# EAGLE design payload-section-B-2 (EAGLE 7.3.0)
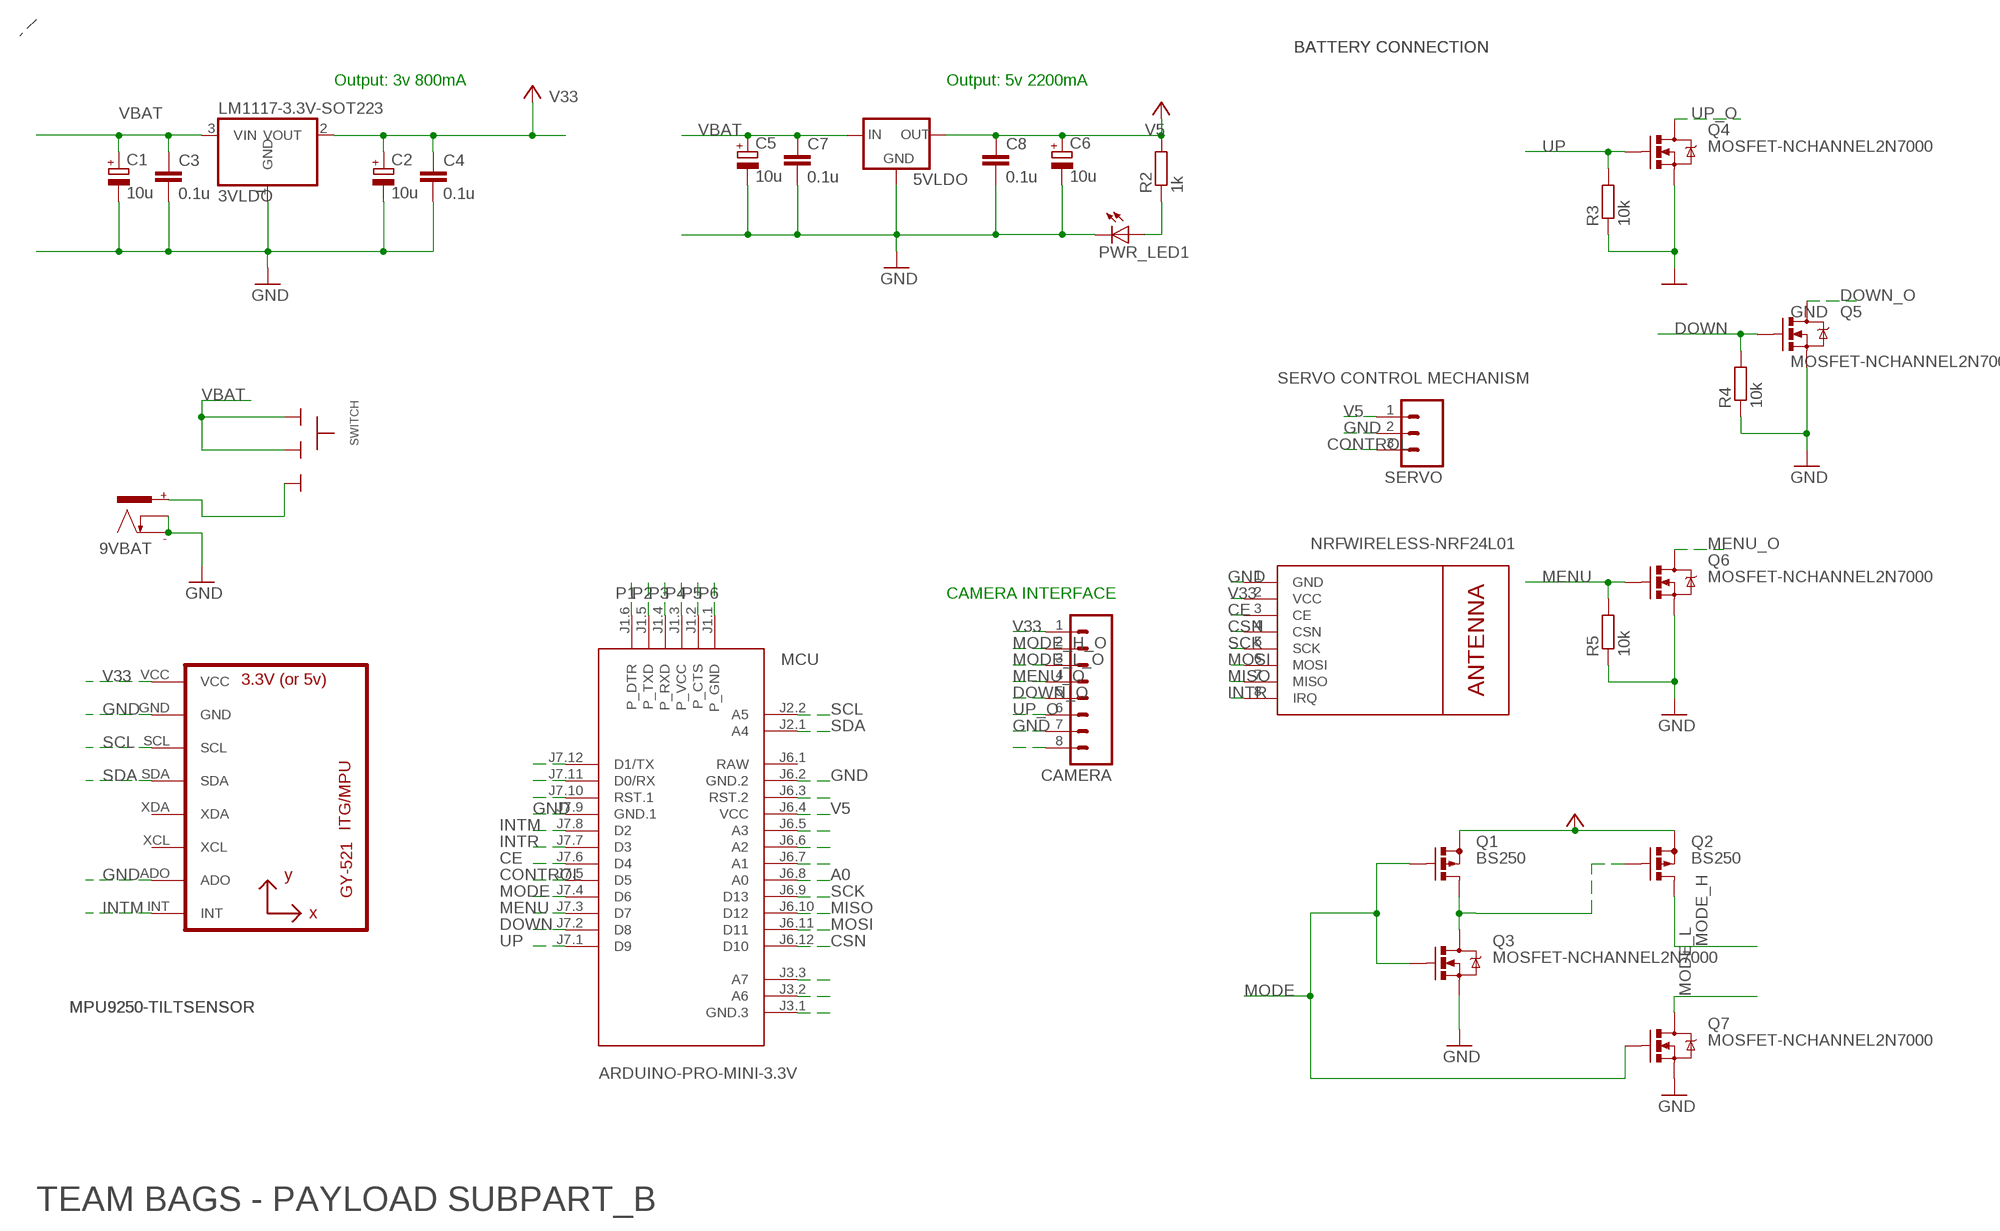
[diagram p0: schematic, sheet 1]

## Parts
3VLDO  LM1117-3.3V-SOT223  [SOT223]
5VLDO  V_REG_78XX-TO-220  [TO-220-ALT]
9VBAT  POWER_CON  [NEB21R]
C1  10u  CPOL-EUCT6032  [CT6032]
C2  10u  CPOL-EUCT6032  [CT6032]
C3  0.1u  C-EUC0805  [C0805]
C4  0.1u  C-EUC0805  [C0805]
C5  10u  CPOL-EUCT6032  [CT6032]
C6  10u  CPOL-EUCT6032  [CT6032]
C7  0.1u  C-EUC0805  [C0805]
C8  0.1u  C-EUC0805  [C0805]
CAMERA  M08  [08P]
MCU  ARDUINO-PRO-MINI-3.3V  [ARDUINO-PRO-MINI]
MPU  GY-521MPU6050  [GY-521]
NRF  WIRELESS-NRF24L01  [WIRELESS-NRF24L01]
PWR_LED1  LED3MM  [LED3MM]
Q1  BS250  [SOT54E]
Q2  BS250  [SOT54E]
Q3  MOSFET-NCHANNEL2N7000  [TO-92]
Q4  MOSFET-NCHANNEL2N7000  [TO-92]
Q5  MOSFET-NCHANNEL2N7000  [TO-92]
Q6  MOSFET-NCHANNEL2N7000  [TO-92]
Q7  MOSFET-NCHANNEL2N7000  [TO-92]
R2  1k  R-EU_R0805  [R0805]
R3  10k  R-EU_R0805  [R0805]
R4  10k  R-EU_R0805  [R0805]
R5  10k  R-EU_R0805  [R0805]
SERVO  M03  [03P]
SWITCH  SLIDESWITCH-BIG  [BIGSWITCH]

## Nets
A0: MCU.J6.8(A0)
CE: MCU.J7.6(D4) NRF.3(CE)
CONTROL: MCU.J7.5(D5) SERVO.3
CSN: MCU.J6.12(D10) NRF.4(CSN)
DOWN: MCU.J7.2(D8) Q5.2(G) R4.2
DOWN_O: CAMERA.5 Q5.3(D)
GND [power]: 3VLDO.1(GND) 5VLDO.GND 9VBAT.- 9VBAT.C C1.- C2.- C3.2 C4.2 C5.- C6.- C7.2 C8.2 CAMERA.7 MCU.J6.2(GND.2) MCU.J7.9(GND.1) MPU.ADO MPU.GND NRF.1(GND) PWR_LED1.K(C) Q3.1(S) Q4.1(S) Q5.1(S) Q6.1(S) Q7.1(S) R3.1 R4.1 R5.1 SERVO.2
INTM: MCU.J7.8(D2) MPU.INT
INTR: MCU.J7.7(D3) NRF.8(IRQ)
MENU: MCU.J7.3(D7) Q6.2(G) R5.2
MENU_O: CAMERA.4 Q6.3(D)
MISO: MCU.J6.10(D12) NRF.7(MISO)
MODE [power]: MCU.J7.4(D6) Q1.G Q3.2(G) Q7.2(G)
MODE_H [power]: Q2.D
MODE_H_O [power]: CAMERA.2
MODE_L: Q7.3(D)
MODE_L_O: CAMERA.3
MOSI: MCU.J6.11(D11) NRF.6(MOSI)
N$1 [power_main]: 9VBAT.+ SWITCH.3
N$2: Q1.D Q2.G Q3.3(D)
N$4: PWR_LED1.A R2.1
N$6: MCU.J6.5(A3)
N$7: MCU.J6.6(A2)
N$8: MCU.J6.7(A1)
N$11: CAMERA.8
N$15: MCU.J3.3(A7)
N$16: MCU.J3.2(A6)
N$17: MCU.J3.1(GND.3)
N$19: MCU.J6.3(RST.2)
N$22: MCU.J7.12(D1/TX)
N$23: MCU.J7.11(D0/RX)
N$24: MCU.J7.10(RST.1)
P1: MCU.J1.6(P_DTR)
P2: MCU.J1.5(P_TXD)
P3: MCU.J1.4(P_RXD)
P4: MCU.J1.3(P_VCC)
P5: MCU.J1.2(P_CTS)
P6: MCU.J1.1(P_GND)
SCK: MCU.J6.9(D13) NRF.5(SCK)
SCL: MCU.J2.2(A5) MPU.SCL
SDA: MCU.J2.1(A4) MPU.SDA
UP: MCU.J7.1(D9) Q4.2(G) R3.2
UP_O: CAMERA.6 Q4.3(D)
V5 [power]: 5VLDO.OUT C6.+ C8.1 MCU.J6.4(VCC) R2.2 SERVO.1 ; supply symbol labelled VCC
V33 [power]: 3VLDO.2(VOUT) C2.+ C4.1 CAMERA.1 MPU.VCC NRF.2(VCC) ; supply symbol labelled VCC
VBAT [power_main]: 3VLDO.3(VIN) 5VLDO.IN C1.+ C3.1 C5.+ C7.1 SWITCH.1 SWITCH.2
VCC [power]: Q1.S Q2.S
Unconnected: MPU.XCL MPU.XDA

## Notes on the sheet
- BATTERY CONNECTION | BATTERY CONNECTION
- Output: 3v 800mA | Output: 5v 2200mA
- SERVO CONTROL MECHANISM
- CAMERA INTERFACE
- MPU9250-TILTSENSOR | MPU9250-TILTSENSOR
- TEAM BAGS - PAYLOAD SUBPART_B

## Power pins joined to a net without a drawn wire
RAW: MCU.J6.1(RAW)

## Library data of the parts
3VLDO = msp framework:LM1117: LM1117 800mA Low Dropout (LDO) Positive Regulator 1.8V, 2.5V, 2.85V, 3.3V, 5V, and Adj Datasheet <www.ti.com/lit/ds/symlink/lm1117.pdf>; SUNROM: 4004
5VLDO = 1 - Jim:V_REG_78XX: Voltage Regulator Standard 7805 5V regulator. IGO (Input Ground Output). Spark Fun Electronics SKU : COM-00107
9VBAT = CEDT_JANUARY_2015_v5:POWER_CON: DC Power Connector
C1 C2 C5 C6 = rcl:CPOL-EU: POLARIZED CAPACITOR, European symbol; SPICEPREFIX: C
C3 C4 C7 C8 = rcl:C-EU: CAPACITOR, European symbol; SPICEPREFIX: C
CAMERA = con-amp-quick:M08: AMP QUICK CONNECTOR; OC_FARNELL: unknown; OC_NEWARK: unknown
MCU = diy-modules:ARDUINO-PRO-MINI-*: Arduino Pro Mini and compatible devices More details available here: https://www.arduino.cc/en/Main/ArduinoBoardProMini Click here to find device on ebay.com <http://www.ebay.com/sch/arduino+pro+mini>
MPU = gy-521:GY-521
NRF = diy-modules:WIRELESS-NRF24L01: 2.4 GHz Wireless Module based on NRF24L01 chip More details available here: http://www.electrodragon.com/w/NRF24L01 Click here to find device on ebay.com <http://www.ebay.com/sch/nrf24l01+arduino>
PWR_LED1 = 01_adafruit:LED: LED OSRAM: - CHIPLED LG R971, LG N971, LY N971, LG Q971, LY Q971, LO R971, LY R971 LH N974, LH R974 LS Q976, LO Q976, LY Q976 LO Q996 - Hyper CHIPLED LW Q18S LB Q993, LB Q99A, LB R99A - SideLED LS A670, LO A670, LY A670, LG A670, LP A670 LB A673, LV A673, LT A673, LW A673 LH A674 LY A675 LS A676, LA A676, LO A676, LY A676, LW A676 LS A679, LY A679, LG A679 - Hyper Micro SIDELED® LS Y876, LA Y876, LO Y876, LY Y876 LT Y87S - SmartLED LW L88C, LW L88S LB L89C, LB L89S, LG L890 LS L89K, LO L89K, LY L89K LS L896, LA L896, LO L896, LY L896 - TOPLED LS T670, LO T670, LY T670, LG T670, LP T670 LSG T670, LSP T670, LSY T670, LOP T670, LYG T670 LG T671, LOG T671, LSG T671 LB T673, LV T673, LT T673, LW T673 LH T674 LS T676, LA T676, LO T676, LY T676, LB T676, LH T676, LSB T676, LW T676 LB T67C, LV T67C, LT T67C, LS T67K, LO T67K, LY T67K, LW E67C LS E67B, LA E67B, LO E67B, LY E67B, LB E67C, LV E67C, LT E67C LW T67C LS T679, LY T679, LG T679 LS T770, LO T770, LY T770, LG T770, LP T770 LB T773, LV T773, LT T773, LW T773 LH T774 LS E675, LA E675, LY E675, LS T675 LS T776, LA T776, LO T776, LY T776, LB T776 LHGB T686 LT T68C, LB T68C - Hyper Mini TOPLED® LB M676 - Mini TOPLED Santana® LG M470 LS M47K, LO M47K, LY M47K Source: http://www.osram.convergy.de/
Q1 Q2 = transistor-small-signal:BS250: P-CHANNEL MOS FET
Q3-Q7 = SparkFun-DiscreteSemi:MOSFET-NCHANNEL: Common NMOSFET Parts MFG P/N Store ID Prod ID FDD8780 TRANS-09984 SI7820DN TRANS-11055 FDS6630A IC-08089 2N7002PW TRANS-11151 FQP30N06L COM-10213 TRANS-10060 BSS123LT1G TRANS-08345 BSS138 TRANS-00830 BS170 2N7000
R2-R5 = rcl:R-EU_: RESISTOR, European symbol; SPICEPREFIX: R
SERVO = con-amp-quick:M03: AMP QUICK CONNECTOR; OC_FARNELL: unknown; OC_NEWARK: unknown
SWITCH = CEDT_JANUARY_2015_v5:SLIDESWITCH

## Net classes
0 default: width 0.406 mm, clearance 0.356 mm
1 power: width 0.61 mm, clearance 0.356 mm
2 power_main: width 0.813 mm, clearance 0.356 mm

## Board
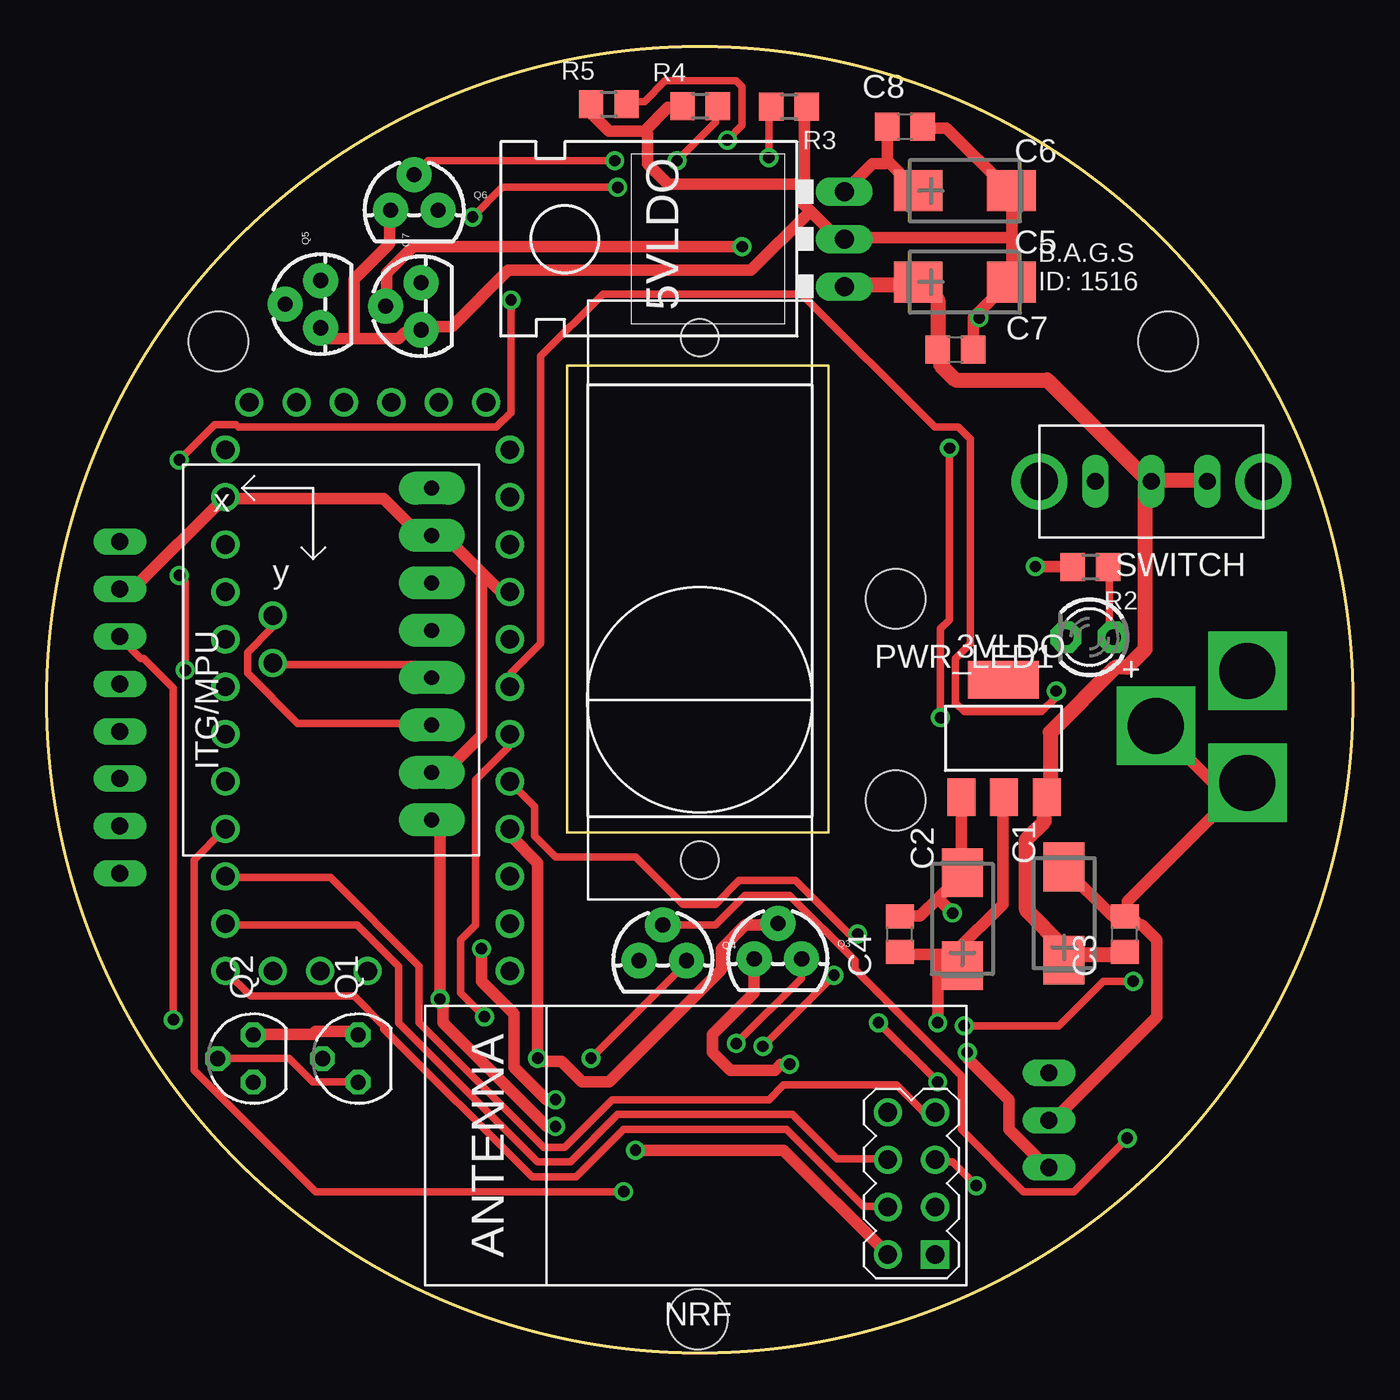
[diagram p1: board, top side]
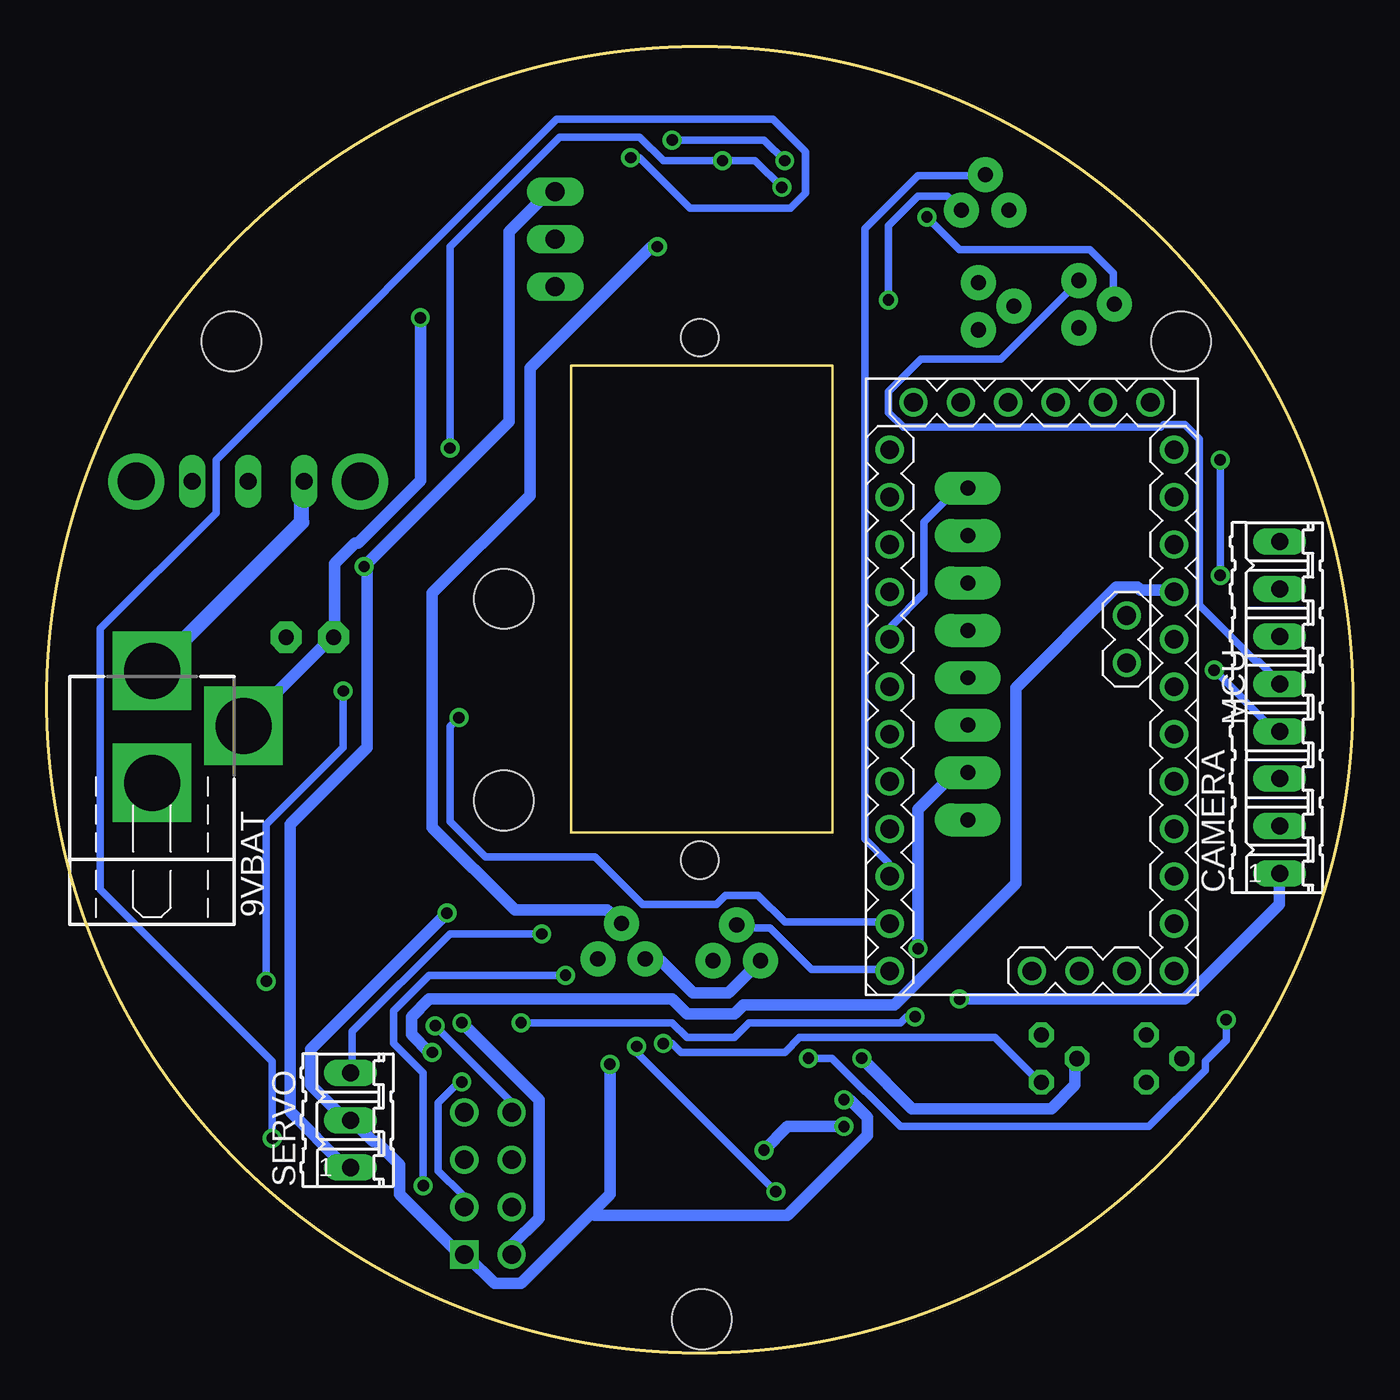
[diagram p2: board, bottom side, seen from below]

Size 70 x 70 mm. Coordinates in mm from the lower left corner, seen from the top.
Outline: circle at 35,35 radius 35
Copper layers (1*16): Top 0.035mm / dielectric 1.5mm / Bottom 0.035mm
Design rules "default": minimum track width 10mil, minimum drill 24mil, track to track 8mil, track to pad 8mil, pad to pad 8mil, via to via 8mil, smd to smd 8mil, copper to edge 40mil, drill to drill 8mil, minimum pad ring 10mil, minimum via ring 8mil, stop-mask expansion 4mil, vias tented up to drill 0mil, thermal gap 10mil
Holes 3.2 mm at 9.2,54.2 60.1,54.2 34.9,1.8 45.5,40.4 45.5,29.6

### Footprints (pad centres in the part's own frame; a part is rotated, then mirrored left to right if it is on the bottom)
SOT223 = smd 1.499 x 2.007: 1 -2.261,-3.15; 2 0.025,-3.15; 3 2.311,-3.15 | smd 3.81 x 2.007: 4 0,3.15
TO-220-ALT = drill 1.016 long: GND 0,-3.81; IN -2.54,-3.81; OUT 2.54,-3.81
NEB21R = drill 3 pad 4.2 square: + 0,3.54; - 0,-2.46; C 4.9,0.59
CT6032 = smd 2.6 x 2.2: + -2.5,0; - 2.5,0
C0805 = smd 1.3 x 1.5: 1 -0.95,0; 2 0.95,0
08P = drill 0.914 long: 1 -8.89,0; 2 -6.35,0; 3 -3.81,0; 4 -1.27,0; 5 1.27,0; 6 3.81,0; 7 6.35,0; 8 8.89,0
ARDUINO-PRO-MINI = drill 1: J1.1 -15.24,6.35; J1.2 -15.24,3.81; J1.3 -15.24,1.27; J1.4 -15.24,-1.27; J1.5 -15.24,-3.81; J1.6 -15.24,-6.35; J2.1 -1.27,5.08; J2.2 -3.81,5.08; J3.1 15.24,0; J3.2 15.24,2.54; J3.3 15.24,5.08; J6.1 -12.7,7.62; J6.2 -10.16,7.62; J6.3 -7.62,7.62; J6.4 -5.08,7.62; J6.5 -2.54,7.62; J6.6 0,7.62; J6.7 2.54,7.62; J6.8 5.08,7.62; J6.9 7.62,7.62; J6.10 10.16,7.62; J6.11 12.7,7.62; J6.12 15.24,7.62; J7.1 15.24,-7.62; J7.2 12.7,-7.62; J7.3 10.16,-7.62; J7.4 7.62,-7.62; J7.5 5.08,-7.62; J7.6 2.54,-7.62; J7.7 0,-7.62; J7.8 -2.54,-7.62; J7.9 -5.08,-7.62; J7.10 -7.62,-7.62; J7.11 -10.16,-7.62; J7.12 -12.7,-7.62
GY-521 = drill 0.8 pad 1.778 long: ADO -8.89,-6.35; GND -8.89,6.35; INT -8.89,-8.89; SCL -8.89,3.81; SDA -8.89,1.27; VCC -8.89,8.89; XCL -8.89,-3.81; XDA -8.89,-1.27
WIRELESS-NRF24L01 = drill 1 square: 1 -12.7,6.35 | drill 1: 2 -10.16,6.35; 3 -12.7,3.81; 4 -10.16,3.81; 5 -12.7,1.27; 6 -10.16,1.27; 7 -12.7,-1.27; 8 -10.16,-1.27
LED3MM = drill 0.813 pad 1.676 octagon: A -1.27,0; K 1.27,0
SOT54E = drill 0.813 octagon: D -1.27,0; G 0,1.905; S 1.27,0
TO-92 = drill 0.813 pad 1.88: 1 -1.27,0; 2 0,1.905; 3 1.27,0
R0805 = smd 1.3 x 1.5: 1 -0.95,0; 2 0.95,0
03P = drill 0.914 long: 1 -2.54,0; 2 0,0; 3 2.54,0
BIGSWITCH = drill 0.9 long: 1 -3,0; 2 0,0; 3 3,0 | drill 2 pad 2.184: TAB1 -6,0; TAB2 6,0
SG90_TOP = hole 2: 4.1,26.5; 4.1,-1.5

### Placement (x,y rotation side)
3VLDO  51.28,32.93 0 top
5VLDO  38.94,59.69 90 top
9VBAT  64.35,33.01 0 bottom
C1  54.52,23.54 90 top
C2  49.07,23.24 90 top
C3  57.77,22.44 90 top
C4  45.72,22.44 90 top
C5  49.2,57.38 0 top
C6  49.2,62.27 0 top
C7  48.7,53.77 0 top
C8  46,65.72 0 top
CAMERA  3.92,34.58 90 bottom
MCU  17.2,35.7 270 bottom
MPU  11.75,37.45 180 top
NRF  34.92,11.62 180 top
PWR_LED1  55.89,38.35 180 top
Q1  16.69,15.77 90 top
Q2  11.07,15.77 90 top
Q3  39.19,21.11 0 top
Q4  33.02,21.02 0 top
Q5  14.69,56.2 90 top
Q6  19.7,61.23 0 top
Q7  20.07,56.09 90 top
R2  55.93,42.1 180 top
R3  39.78,66.77 180 top
R4  35.02,66.82 0 top
R5  30.12,66.91 0 top
SERVO  53.72,12.47 90 bottom
SWITCH  59.2,46.7 180 top
U$1  [SG90_TOP]  30.9,27.9 0 top

### Tracks (layer width: path | path; a pad name or v marks a point on that pad's centre or on a via)
CE  (via drill 0.61)
  Top 0.406: v23.46,18.01 22.19,19.28 22.19,22.14 22.98,22.93 22.98,30.71 24.73,32.45 24.73,33.09 MCU.J7.6 | v47.75,14.52 v44.58,17.69
  Bottom 0.406: v23.46,18.01 23.94,18.01 24.26,17.69 32.35,17.69 33.14,16.9 35.69,16.9 36.48,17.69 v44.58,17.69 | v47.75,14.52 47.91,14.52 49.02,13.41 49.02,9.75 47.75,8.48 47.75,7.85 NRF.3
CONTROL  (via drill 0.61)
  Top 0.406: v43.46,22.45 42.99,22.45 40.13,25.31 37.11,25.31 35.84,24.04 34.1,24.04 31.56,26.58 27.27,26.58 26.16,27.69 26.16,29.28 MCU.J7.5
  Bottom 0.406: v43.46,22.45 48.39,22.45 53.62,17.22 53.62,15.15 SERVO.3
CSN
  Top 0.406: MCU.J6.12 10.92,19.12 16.48,19.12 18.06,17.53 18.06,17.37 26,9.44 28.38,9.44 30.92,11.98 39.65,11.98 43.78,7.85 45.05,7.85 NRF.4
DOWN  (via drill 0.61)
  Top 0.406: v33.78,63.89 35.84,65.95 35.84,66.75 R4.2 | v30.61,62.46 24.41,62.46 v22.83,60.87 | v47.91,34.04 47.91,38.81 48.39,39.28 v48.39,48.49
  Bottom 0.406: v30.61,62.46 32.03,63.89 v33.78,63.89 36.95,63.89 38.23,65.16 42.51,65.16 48.39,59.28 v48.39,48.49 | v22.83,60.87 21.08,59.12 14.1,59.12 12.83,57.86 12.83,56.27 Q5.2 | v47.91,34.04 48.39,33.57 48.39,28.49 46.48,26.58 40.61,26.58 38.07,24.04 34.1,24.04 33.62,24.52 31.88,24.52 30.45,23.09 24.89,23.09 MCU.J7.2
DOWN_O
  Bottom 0.406: CAMERA.5 3.94,35.95 5.05,37.06 5.21,37.06 8.22,40.08 8.22,48.97 9.02,49.76 10.13,49.76 10.29,49.6 24.1,49.6 24.89,50.39 24.89,51.51 23.14,53.25 18.86,53.25 14.73,57.38 Q5.3
GND  (via drill 0.61)
  Top 0.61: 16.48,54.36 15.21,54.36 14.73,54.84 Q5.1 | 16.48,54.36 18.86,54.36 19.18,54.68 19.97,54.68 Q7.1 20.29,55 21.72,55 24.73,58.01 37.75,58.01 40.92,61.19 | 16.48,54.36 16.48,57.54 18.38,59.44 18.38,61.19 Q6.1 | 49.81,55.63 51.56,57.38 C5.- 51.72,57.54 51.72,59.76 | 49.81,55.63 49.66,55.47 49.66,53.89 C7.2 | C8.2 46.96,65.63 48.23,65.63 51.56,62.3 C6.- 51.72,61.98 51.72,59.76 | 32.03,65.48 33.3,66.75 33.94,66.75 R4.1 | 32.03,65.48 30.13,65.48 29.18,66.43 R5.1 | 40.45,62.62 40.61,62.78 40.61,66.75 R3.1 | 40.45,62.62 40.45,61.67 40.92,61.19 | 40.92,61.19 42.35,59.76 42.67,59.76 5VLDO.GND 42.99,59.76 51.72,59.76 | 40.45,62.62 33.3,62.62 32.19,63.73 32.19,65.32 32.03,65.48 | CAMERA.7 3.94,41.03 4.73,41.03 9.49,45.79 MCU.J6.2 9.81,45.79 18.06,45.79 19.81,44.04 20.45,44.04 MPU.ADO 20.76,43.73 21.4,43.73 23.46,41.66 | 23.46,41.66 24.26,40.87 24.73,40.87 MCU.J7.9 | MPU.GND 20.76,31.19 21.4,31.19 23.3,33.09 23.3,41.5 23.46,41.66 | C3.2 57.75,23.41 57.12,23.41 54.58,25.95 C1.- | C3.2 57.91,23.57 57.91,24.2 64.26,30.55 9VBAT.- 63.31,29.76 59.5,33.57 9VBAT.C | 47.75,24.36 49.02,25.63 C2.- 49.02,25.95 49.02,29.76 3VLDO.1 | 47.75,24.36 46.8,23.41 45.84,23.41 C4.2 | v48.54,23.57 47.75,24.36 | v39.81,15.47 39.34,15.47 39.02,15.15 36.64,15.15 35.69,16.1 35.69,17.06 37.91,19.28 37.91,21.03 Q3.1 | C3.2 58.07,23.41 58.55,22.93 58.7,22.93 59.5,22.14 59.5,18.01 54.1,12.61 53.78,12.61 SERVO.2 | v23.3,21.66 23.3,19.91 25.05,18.17 25.05,15.31 26.8,13.56 v27.27,13.56 | v49.97,55.47 49.81,55.63
  Bottom 0.61: 9VBAT.C 59.34,33.73 54.73,38.33 PWR_LED1.K 54.58,38.65 54.58,42.3 53.47,43.41 53.31,43.41 49.97,46.74 v49.97,55.47 | Q4.1 31.88,20.87 33.46,19.28 35.37,19.28 37.11,21.03 37.91,21.03 Q3.1 | v48.54,23.57 55.85,16.26 55.85,14.36 53.94,12.45 SERVO.2 53.62,12.45 52.51,11.34 52.35,11.34 51.08,10.07 51.08,8.48 47.75,5.15 NRF.1 47.43,5.15 46,3.72 44.58,3.72 40.77,7.53 | v39.81,15.47 39.81,8.48 40.77,7.53 | v23.3,21.66 23.3,29.12 21.4,31.03 20.76,31.03 MPU.GND | v27.27,13.56 26.95,13.56 26,12.61 26,11.66 30.29,7.37 40.61,7.37 40.77,7.53
INTM
  Bottom 0.406: MCU.J7.8 24.73,38.33 24.73,38.96 22.98,40.71 22.98,44.52 21.24,46.27 20.76,46.27 MPU.INT
INTR  (via drill 0.61)
  Top 0.406: v54.1,35.47 54.1,35.15 53.31,34.36 49.18,34.36 48.7,34.84 48.7,37.22 49.5,38.01 49.5,48.97 48.86,49.6 47.59,49.6 40.45,56.74 29.81,56.74 26.48,53.41 26.48,38.01 24.89,36.42 24.89,35.79 MCU.J7.7 | v58.23,19.91 56.64,19.91 54.26,17.53 v49.18,17.53
  Bottom 0.406: v54.1,35.47 54.1,32.45 58.23,28.33 v58.23,19.91 | v49.18,17.53 45.21,13.56 45.21,12.93 NRF.8
MENU  (via drill 0.61)
  Top 0.406: v36.48,65 37.27,65.79 37.27,67.86 36.95,68.17 33.14,68.17 32.03,67.06 31.08,67.06 R5.2 | v30.45,63.89 20.45,63.89 19.81,63.25 Q6.2
  Bottom 0.406: v36.48,65 31.56,65 v30.45,63.89 | MCU.J7.3 24.89,25.63 24.89,26.26 26.16,27.53 26.16,60.24 23.3,63.09 19.81,63.09 Q6.2
MENU_O  (via drill 0.61)
  Top 0.406: v7.43,36.58 7.43,41.34 v7.11,41.66 | v7.11,47.85 9.02,49.76 10.13,49.76 10.29,49.6 24.1,49.6 24.89,50.39 v24.89,56.43
  Bottom 0.406: v7.43,36.58 4.25,33.41 3.94,33.41 CAMERA.4 | v7.11,47.85 v7.11,41.66 | v24.89,56.43 24.89,60.39 23.3,61.98 21.72,61.98 21.08,61.35 Q6.3
MISO
  Top 0.406: NRF.7 47.59,12.93 46.96,12.93 45.53,14.36 39.5,14.36 38.7,13.56 30.29,13.56 27.75,11.02 26.64,11.02 19.97,17.69 19.97,20.71 15.21,25.47 9.65,25.47 MCU.J6.10
MODE  (via drill 0.61)
  Top 0.61: MCU.J7.4 24.89,28.01 24.89,27.69 26.32,26.26 v26.32,15.79 26.48,15.63 27.59,15.63 28.7,14.52 30.13,14.52 36.16,20.55 36.16,21.66 37.43,22.93 39.18,22.93 Q3.2 | v37.27,59.28 19.65,59.28 18.22,57.86 18.22,56.11 Q7.2
  Bottom 0.61: v26.32,15.79 23.62,13.09 16.16,13.09 14.89,14.36 14.89,15.63 Q1.G | v37.27,59.28 37.59,59.28 44.1,52.78 44.1,45.95 49.34,40.71 49.34,28.17 44.89,23.72 39.97,23.72 39.34,23.09 Q3.2
MOSI
  Top 0.406: NRF.6 45.05,10.39 42.35,10.39 39.97,12.77 30.61,12.77 28.07,10.23 26.32,10.23 18.86,17.69 18.86,20.71 16.64,22.93 9.65,22.93 MCU.J6.11
N$1
  Bottom 0.813: SWITCH.3 56.32,46.58 56.32,44.52 64.26,36.58 9VBAT.+
N$2  (via drill 0.61)
  Top 0.406: Q2.G 9.17,15.79 12.98,15.79 14.25,14.52 16.64,14.52 Q1.D | v36.95,16.58 40.45,20.07 40.45,21.03 Q3.3
  Bottom 0.406: v36.95,16.58 36.48,16.58 36,16.1 30.45,16.1 29.65,16.9 19.18,16.9 16.79,14.52 Q1.D
N$4
  Top 0.406: R2.1 56.96,41.98 56.96,38.65 57.12,38.49 PWR_LED1.A
SCK  (via drill 0.61)
  Top 0.406: v49.81,8.96 48.54,10.23 47.75,10.23 NRF.5 | v38.38,16.42 v42.19,20.23 | v30.92,8.64 14.41,8.64 7.9,15.15 7.9,26.42 9.49,28.01 MCU.J6.9
  Bottom 0.406: v49.81,8.96 49.81,14.99 51.4,16.58 51.4,18.33 49.5,20.23 v42.19,20.23 | v38.38,16.42 38.38,16.1 v30.92,8.64
SCL
  Top 0.406: MCU.J2.2 12.03,39.44 12.03,38.81 10.76,37.53 10.76,36.42 13.46,33.73 20.6,33.73 MPU.SCL
SDA
  Top 0.406: MCU.J2.1 12.19,36.9 19.97,36.9 20.6,36.27 MPU.SDA
UP  (via drill 0.61)
  Top 0.406: v38.7,64.05 38.7,66.75 R3.2 | v57.91,11.5 55.05,8.64 52.35,8.64 49.02,11.98 49.02,14.83 43.31,20.55 43.31,21.03 39.81,24.52 37.43,24.52 35.84,22.93 33.14,22.93 Q4.2
  Bottom 0.406: v38.7,64.05 38.23,64.05 35.53,61.35 30.13,61.35 29.34,62.14 29.34,64.36 31.08,66.11 42.67,66.11 60.93,47.85 60.93,45 67.12,38.81 67.12,24.84 57.91,15.63 v57.91,11.5 | MCU.J7.1 24.89,20.55 29.02,20.55 31.24,22.77 32.99,22.77 Q4.2
UP_O  (via drill 0.61)
  Top 0.406: v6.79,17.85 6.79,35.63 5.21,37.22 5.05,37.22 3.94,38.33 CAMERA.6 | v29.18,15.79 34.26,20.87 Q4.3
  Bottom 0.406: v6.79,17.85 6.79,16.74 7.9,15.63 7.9,15.15 10.92,12.14 24.26,12.14 27.91,15.79 v29.18,15.79
V5  (via drill 0.61)
  Top 0.61: 45.05,63.89 45.05,65.63 C8.1 | 45.05,63.89 46.64,62.3 C6.+ | v52.99,42.14 54.89,42.14 R2.2 | v49.34,16.1 49.34,15.79 51.56,13.56 51.56,11.98 53.62,9.91 SERVO.1 | 45.05,63.89 44.89,63.73 44.26,63.73 42.83,62.3 5VLDO.OUT
  Bottom 0.61: 5VLDO.OUT 42.83,62.14 43.15,62.14 45.21,60.08 45.21,49.92 v52.99,42.14 52.83,41.98 52.83,32.45 56.96,28.33 56.96,12.93 54.1,10.07 53.78,10.07 SERVO.1 | v49.34,16.1 49.5,16.1 50.45,17.06 50.45,18.01 49.5,18.96 36.48,18.96 35.69,18.17 33.14,18.17 32.67,18.64 24.57,18.64 18.06,25.15 18.06,35.63 12.67,41.03 11.55,41.03 11.4,40.87 9.65,40.87 MCU.J6.4
V33  (via drill 0.61)
  Top 0.61: MPU.VCC 20.76,28.49 21.08,28.17 v21.08,18.96 21.24,18.8 21.24,17.69 26.8,12.14 v27.27,12.14 | 47.75,21.34 48.54,21.34 49.02,20.87 C2.+ 48.7,21.5 51.24,24.04 51.24,29.76 3VLDO.2 | 47.75,21.34 45.84,21.34 C4.1 | 47.75,21.34 v47.75,17.69 | v31.56,10.87 39.5,10.87 45.05,5.31 NRF.2
  Bottom 0.61: v21.08,18.96 9.02,18.96 3.94,24.04 3.94,25.63 CAMERA.1 | v47.75,17.69 43.62,13.56 43.62,7.21 45.05,5.79 45.05,5.31 NRF.2 | v27.27,12.14 30.29,12.14 v31.56,10.87
VBAT
  Top 0.813: C3.1 57.75,21.34 54.73,21.34 54.58,21.18 C1.+ 54.58,21.66 52.51,23.72 52.51,27.53 53.47,28.49 53.47,29.76 3VLDO.3 53.78,30.07 53.78,33.25 57.28,36.74 57.91,36.74 58.86,37.69 58.86,46.42 SWITCH.2 | SWITCH.2 59.34,46.74 62.2,46.74 SWITCH.1 | 5VLDO.IN 42.83,57.22 46.32,57.22 C5.+ 46.8,57.38 47.75,56.43 C7.1 47.91,53.41 47.91,52.93 48.7,52.14 53.62,52.14 58.86,46.9 SWITCH.2
VCC
  Top 0.61: Q2.S 11.08,17.06 14.25,17.06 14.41,17.22 16.48,17.22 16.64,17.06 Q1.S

### Text on the board
tPlace: B.A.G.S / ID: 1516